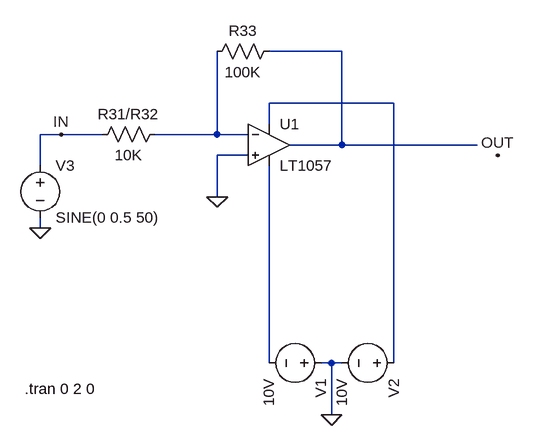
[diagram p0: schematic OpAmpInvert.asc]
OpAmpInvert.asc, the LTspice schematic file:
Version 4
SHEET 1 880 680
WIRE 272 -128 160 -128
WIRE 352 -48 160 -48
WIRE 160 -16 160 -48
WIRE -160 0 -192 0
WIRE -96 0 -160 0
WIRE 80 0 80 -128
WIRE 80 0 -16 0
WIRE 128 0 80 0
WIRE 272 16 272 -128
WIRE 272 16 192 16
WIRE 480 16 272 16
WIRE 128 32 80 32
WIRE -192 48 -192 0
WIRE 80 96 80 32
WIRE -192 144 -192 128
WIRE 160 352 160 48
WIRE 256 352 240 352
WIRE 272 352 256 352
WIRE 352 352 352 -48
WIRE 256 432 256 352
FLAG 80 96 0
FLAG 256 432 0
FLAG 512 32 OUT
FLAG -160 0 IN
FLAG -192 144 0
SYMBOL res 0 -16 R90
WINDOW 0 0 56 VBottom 2
WINDOW 3 32 56 VTop 2
SYMATTR InstName R31/R32
SYMATTR Value 10K
SYMATTR SpiceLine tol=1 pwr=0.1
SYMBOL res 176 -144 R90
WINDOW 0 0 56 VBottom 2
WINDOW 3 32 56 VTop 2
SYMATTR InstName R33
SYMATTR Value 100K
SYMATTR SpiceLine tol=1 pwr=0.1
SYMBOL voltage 256 352 R90
WINDOW 123 0 0 Left 2
WINDOW 39 0 0 Left 2
SYMATTR InstName V1
SYMATTR Value 10V
SYMBOL voltage 368 352 R90
WINDOW 123 0 0 Left 2
WINDOW 39 0 0 Left 2
SYMATTR InstName V2
SYMATTR Value 10V
SYMBOL Opamps\\LT1057 160 -48 R0
SYMATTR InstName U1
SYMBOL voltage -192 32 R0
WINDOW 123 0 0 Left 2
WINDOW 39 0 0 Left 2
SYMATTR InstName V3
SYMATTR Value SINE(0 0.5 50)
TEXT -216 392 Left 2 !.tran 0 2 0

The netlist it stands for:
* OpAmpInvert.asc
R31/R32 N003 IN 10K tol=1 pwr=0.1
R33 N001 N003 100K tol=1 pwr=0.1
V1 0 N004 10V
V2 N002 0 10V
XU1 0 N003 N002 N004 N001 LT1057  ; pins In+ In- V+ V- OUT
V3 IN 0 SINE(0 0.5 50)
.tran 0 2 0
.lib LTC.lib
.backanno
.end